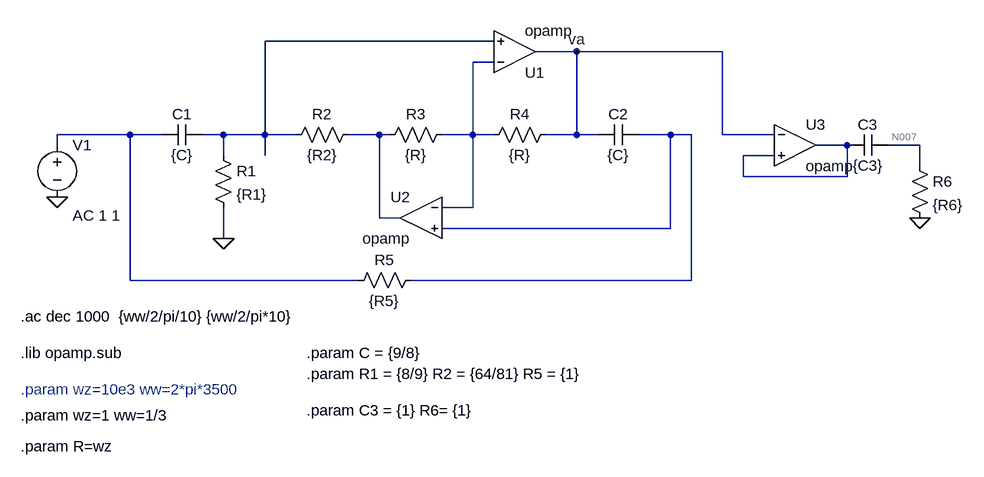
[diagram p0: schematic Circuito.asc]
Circuito.asc, the LTspice schematic file:
Version 4
SHEET 1 932 688
WIRE 192 48 -160 48
WIRE 320 64 256 64
WIRE 544 64 320 64
WIRE 192 80 160 80
WIRE -368 192 -480 192
WIRE -320 192 -368 192
WIRE -224 192 -256 192
WIRE -160 192 -160 48
WIRE -160 192 -224 192
WIRE -112 192 -160 192
WIRE 16 192 -32 192
WIRE 32 192 16 192
WIRE 160 192 160 80
WIRE 160 192 112 192
WIRE 192 192 160 192
WIRE 320 192 320 64
WIRE 320 192 272 192
WIRE 352 192 320 192
WIRE 464 192 416 192
WIRE 496 192 464 192
WIRE 544 192 544 64
WIRE 624 192 544 192
WIRE -480 208 -480 192
WIRE 736 208 688 208
WIRE 848 208 800 208
WIRE -224 224 -224 192
WIRE -160 224 -160 192
WIRE 624 224 576 224
WIRE 848 240 848 208
WIRE 576 256 576 224
WIRE 736 256 736 208
WIRE 736 256 576 256
WIRE 160 304 160 192
WIRE 160 304 112 304
WIRE 16 320 16 192
WIRE 48 320 16 320
WIRE 464 336 464 192
WIRE 464 336 112 336
WIRE -224 352 -224 304
WIRE -368 416 -368 192
WIRE -16 416 -368 416
WIRE 496 416 496 192
WIRE 496 416 64 416
FLAG 320 64 va
FLAG -224 352 0
FLAG -480 288 0
FLAG 848 320 0
SYMBOL voltage -480 192 R0
WINDOW 123 24 124 Left 2
WINDOW 39 0 0 Left 0
SYMATTR Value2 AC 1 1
SYMATTR InstName V1
SYMATTR Value ""
SYMBOL OpAmps\\opamp 224 128 M180
SYMATTR InstName U1
SYMBOL OpAmps\\opamp 80 256 M0
SYMATTR InstName U2
SYMBOL cap 416 176 R90
WINDOW 0 0 32 VBottom 2
WINDOW 3 32 32 VTop 2
SYMATTR InstName C2
SYMATTR Value {C}
SYMBOL res 288 176 R90
WINDOW 0 0 56 VBottom 2
WINDOW 3 32 56 VTop 2
SYMATTR InstName R4
SYMATTR Value {R}
SYMBOL res 128 176 R90
WINDOW 0 0 56 VBottom 2
WINDOW 3 32 56 VTop 2
SYMATTR InstName R3
SYMATTR Value {R}
SYMBOL res -16 176 R90
WINDOW 0 0 56 VBottom 2
WINDOW 3 32 56 VTop 2
SYMATTR InstName R2
SYMATTR Value {R2}
SYMBOL res -240 208 R0
SYMATTR InstName R1
SYMATTR Value {R1}
SYMBOL cap -256 176 R90
WINDOW 0 0 32 VBottom 2
WINDOW 3 32 32 VTop 2
SYMATTR InstName C1
SYMATTR Value {C}
SYMBOL res 80 400 R90
WINDOW 0 0 56 VBottom 2
WINDOW 3 32 56 VTop 2
SYMATTR InstName R5
SYMATTR Value {R5}
SYMBOL OpAmps\\opamp 656 144 R0
SYMATTR InstName U3
SYMBOL cap 800 192 R90
WINDOW 0 0 32 VBottom 2
WINDOW 3 32 32 VTop 2
SYMATTR InstName C3
SYMATTR Value {C3}
SYMBOL res 832 224 R0
SYMATTR InstName R6
SYMATTR Value {R6}
TEXT -536 528 Left 2 !.lib opamp.sub
TEXT -536 584 Left 2 ;.param wz=10e3 ww=2*pi*3500
TEXT -536 672 Left 2 !.param R=wz
TEXT -536 624 Left 2 !.param wz=1 ww=1/3
TEXT -96 528 Left 2 !.param C = {9/8}
TEXT -96 560 Left 2 !.param R1 = {8/9} R2 = {64/81} R5 = {1}
TEXT -96 616 Left 2 !.param C3 = {1} R6= {1}
TEXT -536 472 Left 2 !.ac dec 1000  {ww/2/pi/10} {ww/2/pi*10}

The netlist it stands for:
* Circuito.asc
V1 N003 0 AC 1 1
XU1 N002 N001 va opamp Aol=100K GBW=10Meg  ; pins invin noninvin out
XU2 N002 N005 N004 opamp Aol=100K GBW=10Meg  ; pins invin noninvin out
C2 N005 va {C}
R4 va N002 {R}
R3 N002 N004 {R}
R2 N004 N001 {R2}
R1 N001 0 {R1}
C1 N001 N003 {C}
R5 N005 N003 {R5}
XU3 va N006 N006 opamp Aol=100K GBW=10Meg  ; pins invin noninvin out
C3 N007 N006 {C3}
R6 N007 0 {R6}
.lib opamp.sub
* .param wz=10e3 ww=2*pi*3500
.param R=wz
.param wz=1 ww=1/3
.param C = {9/8}
.param R1 = {8/9} R2 = {64/81} R5 = {1}
.param C3 = {1} R6= {1}
.ac dec 1000  {ww/2/pi/10} {ww/2/pi*10}
.backanno
.end

* Results of the author's LTspice run, read from the files saved beside the schematic
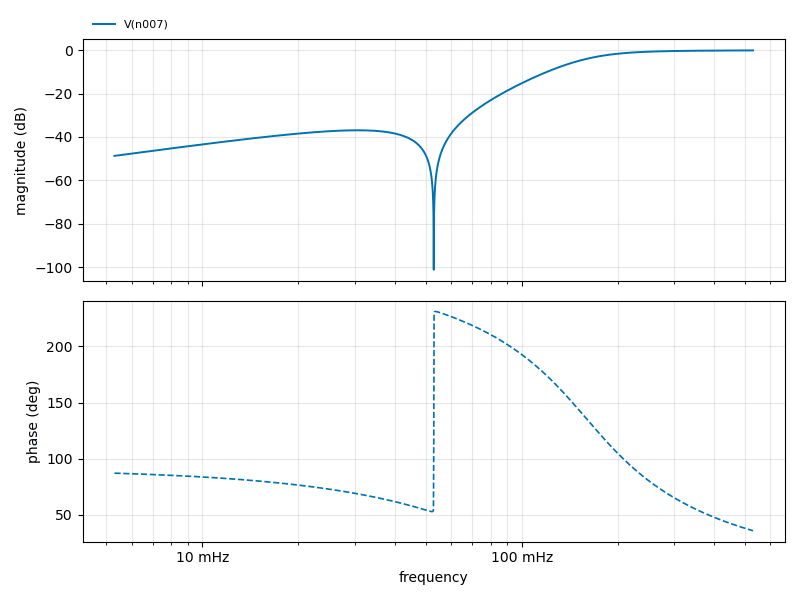
[diagram p1: AC Analysis of Circuito.asc, plotted from the saved traces]
* AC Analysis, 1 run:
*   V(n007): -48.71 dB at 5.305 mHz, -0.09 dB at 530.5 mHz, peak -0.09 dB at 530.5 mHz, 3 dB below the peak at 170.4 mHz